# EAGLE design FluxamapadAwithAutoDetect (EAGLE 5.06)
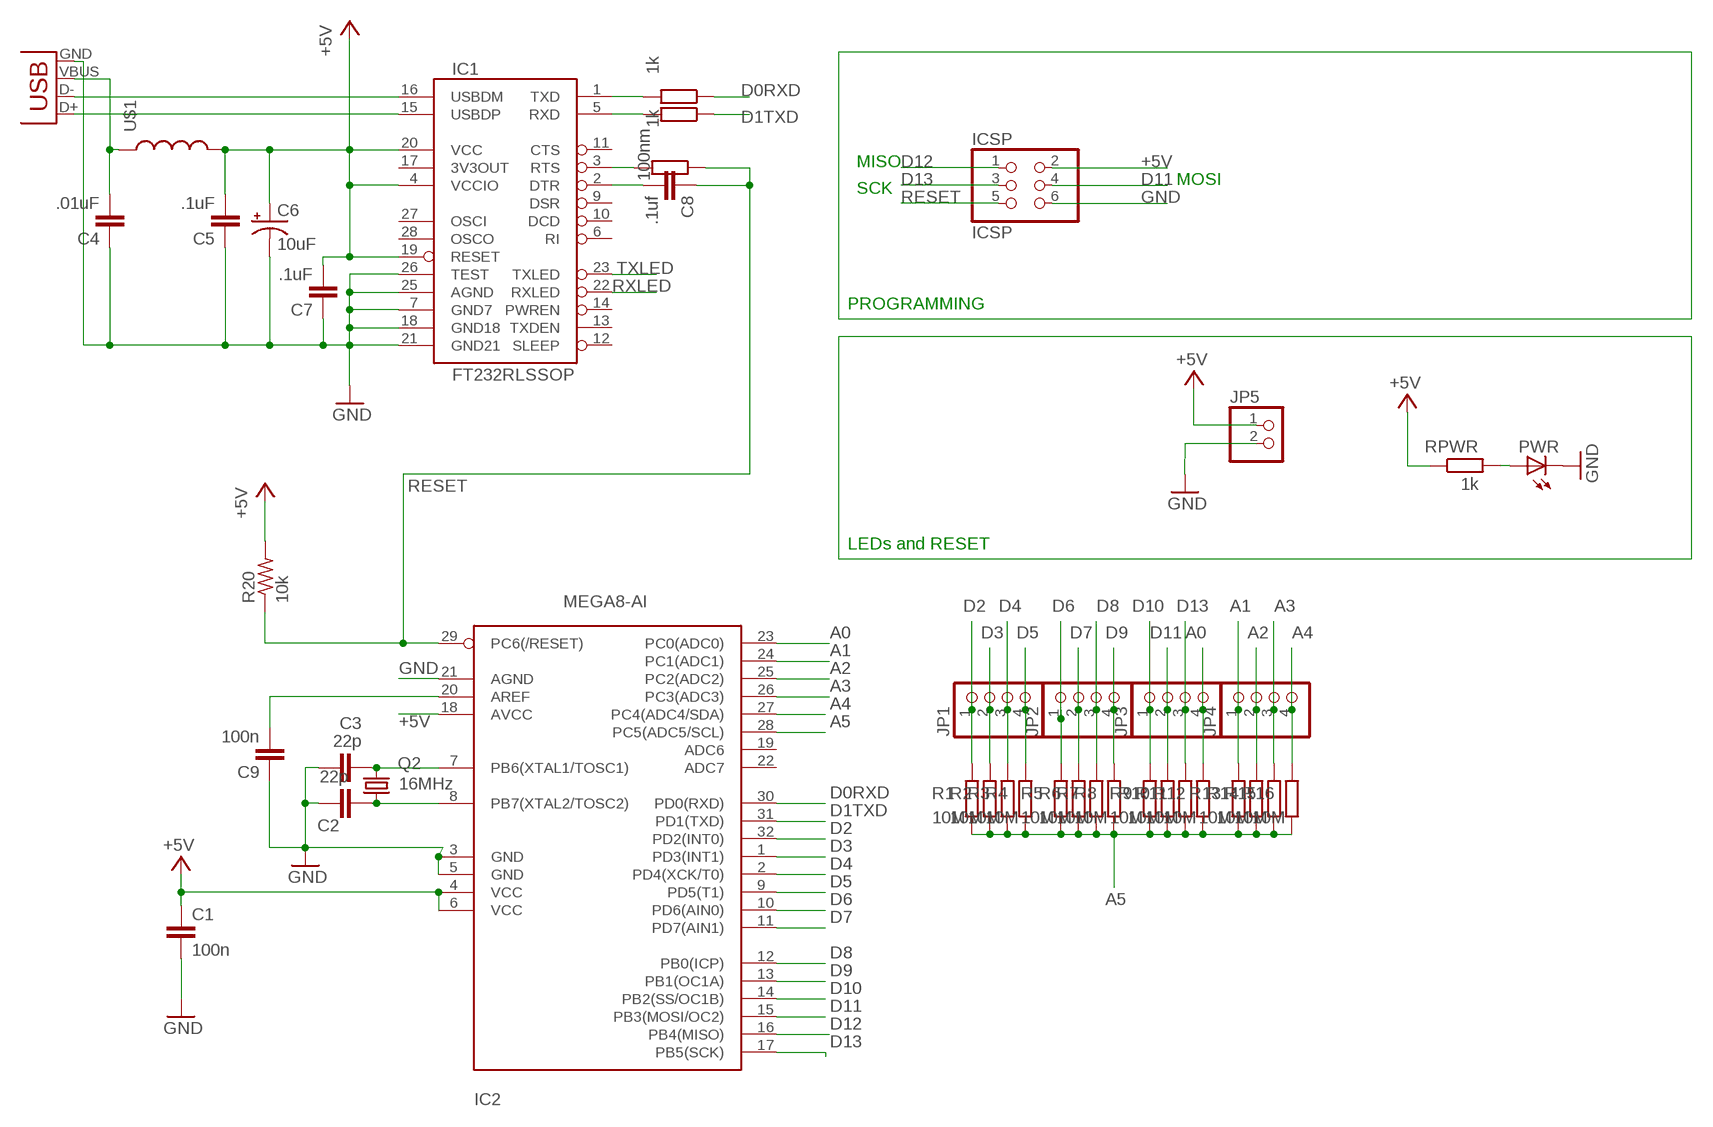
[diagram p0: schematic, sheet 1]

## Parts
C1  100n  C-EU  [C0805RND]
C2  22p  C-EU  [C0805RND]
C3  22p  C-EU  [C0805RND]
C4  .01uF  C-EU  [C0805RND]
C5  .1uF  C-EU  [C0805RND]
C6  10uF  CPOL-US150CLZ-1014  [150CLZ-1014]
C7  .1uF  C-EU  [C0805RND]
C8  .1uf  C-EU  [C0805RND]
C9  100n  C-EU  [C0805RND]
IC1  FT232RLSSOP  [SSOP28DB]
IC2  MEGA8-AI  [TQFP32-08]
ICSP  ICSP  PINHD-2X3  [2X03]
JP1  PINHD-1X4  [1X04]
JP2  PINHD-1X4  [1X04]
JP3  PINHD-1X4  [1X04]
JP4  PINHD-1X4  [1X04]
JP5  PINHD-1X2  [1X02]
PWR  LED0805ROUND  [0805RND]
Q2  16MHz  CRYTALHC49S  [HC49/S]
R1  10M  R-EU_R1206  [R1206]
R2  10M  R-EU_R1206  [R1206]
R3  10M  R-EU_R1206  [R1206]
R4  10M  R-EU_R1206  [R1206]
R5  10M  R-EU_R1206  [R1206]
R6  10M  R-EU_R1206  [R1206]
R7  10M  R-EU_R1206  [R1206]
R8  10M  R-EU_R1206  [R1206]
R9  10M  R-EU_R1206  [R1206]
R10  10M  R-EU_R1206  [R1206]
R11  10M  R-EU_R1206  [R1206]
R12  10M  R-EU_R1206  [R1206]
R13  10M  R-EU_R1206  [R1206]
R14  10M  R-EU_R1206  [R1206]
R15  10M  R-EU_R1206  [R1206]
R16  10M  R-EU_R1206  [R1206]
R17  1k  R-EU_R1206  [R1206]
R18  1k  R-EU_R1206  [R1206]
R19  100nm  R-EU_R1206  [R1206]
R20  10k  R-US_R1206  [R1206]
RPWR  1k  R-EU_R1206  [R1206]
U$1  INDUCTOR1206H*  [INDUCTOR-1206]
X1  USBPTH  [USB-B-PTH]

## Nets
+5V [usbvcc]: C1.1 C5.2 C6.+ C7.2 IC1.4(VCCIO) IC1.19(RESET) IC1.20(VCC) IC2.4(VCC) IC2.6(VCC) IC2.18(AVCC) ICSP.2 JP5.1 R20.2 RPWR.1 U$1.P$2
A0: IC2.23(PC0(ADC0)) JP3.4 R12.2
A1: IC2.24(PC1(ADC1)) JP4.1 R13.2
A2: IC2.25(PC2(ADC2)) JP4.2 R14.2
A3: IC2.26(PC3(ADC3)) JP4.3 R15.2
A4: IC2.27(PC4(ADC4/SDA)) JP4.4 R16.2
A5: IC2.28(PC5(ADC5/SCL)) R1.1 R2.1 R3.1 R4.1 R5.1 R6.1 R7.1 R8.1 R9.1 R10.1 R11.1 R12.1 R13.1 R14.1 R15.1 R16.1
D0RXD: IC2.30(PD0(RXD)) R17.1
D1TXD: IC2.31(PD1(TXD)) R18.1
D2: IC2.32(PD2(INT0)) JP1.1 R1.2
D3: IC2.1(PD3(INT1)) JP1.2 R2.2
D4: IC2.2(PD4(XCK/T0)) JP1.3 R3.2
D5: IC2.9(PD5(T1)) JP1.4 R4.2
D6: IC2.10(PD6(AIN0)) JP2.1 R5.2
D7: IC2.11(PD7(AIN1)) JP2.2 R6.2
D8: IC2.12(PB0(ICP)) JP2.3 R7.2
D9: IC2.13(PB1(OC1A)) JP2.4 R8.2
D10: IC2.14(PB2(SS/OC1B)) JP3.1 R9.2
D11: IC2.15(PB3(MOSI/OC2)) ICSP.4 JP3.2 R10.2
D12: IC2.16(PB4(MISO)) ICSP.1
D13: IC2.17(PB5(SCK)) ICSP.3 JP3.3 R11.2
GND [gnd]: C1.2 C2.1 C3.1 C4.1 C5.1 C6.- C7.1 C9.1 IC1.7(GND7) IC1.18(GND18) IC1.21(GND21) IC1.25(AGND) IC1.26(TEST) IC2.3(GND) IC2.5(GND) IC2.21(AGND) ICSP.6 JP5.2 PWR.P$2(C) X1.GND
N$1: C4.2 U$1.P$1 X1.VBUS
N$2: C9.2 IC2.20(AREF)
N$3: PWR.P$1(A) RPWR.2
N$6: IC1.3(RTS) R19.2
N$7: C3.2 IC2.7(PB6(XTAL1/TOSC1)) Q2.2
N$8: IC1.15(USBDP) X1.D+
N$9: IC1.1(TXD) R17.2
N$10: IC1.16(USBDM) X1.D-
N$11: IC1.5(RXD) R18.2
N$12: C8.2 IC1.2(DTR)
N$24: C2.2 IC2.8(PB7(XTAL2/TOSC2)) Q2.1
RESET: C8.1 IC2.29(PC6(/RESET)) ICSP.5 R19.1 R20.1
RXLED: IC1.22(RXLED)
TXLED: IC1.23(TXLED)
Unconnected: IC1.6(RI) IC1.9(DSR) IC1.10(DCD) IC1.11(CTS) IC1.12(SLEEP) IC1.13(TXDEN) IC1.14(PWREN) IC1.17(3V3OUT) IC1.27(OSCI) IC1.28(OSCO) IC2.19(ADC6) IC2.22(ADC7)

## Notes on the sheet
- MISO
- MOSI
- SCK
- PROGRAMMING
- LEDs and RESET

## Library data of the parts
C1-C5 C7-C9 = rcl:C-EU: CAPACITOR, European symbol
C6 = rcl:CPOL-US: POLARIZED CAPACITOR, American symbol
IC1 = SparkFun:FT232RL: USB UART FT232RL 4th Generation USB UART (USB <-> Serial) Controller. Spark Fun Electronics SKU : COM-00650
IC2 = atmel:MEGA8: MICROCONTROLLER 8 Kbytes FLASH, 1 kbytes SRAM, 512 bytes EEPROM, USART, 6-channel 10 bit ADC, 2-channel 8 bit ADC Pin compatible with Atmega48, ATMega88, ATMega168 Source: avr.lbr
ICSP = pinhead:PINHD-2X3: PIN HEADER
JP1-JP4 = pinhead:PINHD-1X4: PIN HEADER
JP5 = pinhead:PINHD-1X2: PIN HEADER
PWR = led:LED: LED OSRAM: - CHIPLED LG R971, LG N971, LY N971, LG Q971, LY Q971, LO R971, LY R971 LH N974, LH R974 LS Q976, LO Q976, LY Q976 LO Q996 - Hyper CHIPLED LW Q18S LB Q993, LB Q99A, LB R99A - SideLED LS A670, LO A670, LY A670, LG A670, LP A670 LB A673, LV A673, LT A673, LW A673 LH A674 LY A675 LS A676, LA A676, LO A676, LY A676, LW A676 LS A679, LY A679, LG A679 - Hyper Micro SIDELED® LS Y876, LA Y876, LO Y876, LY Y876 LT Y87S - SmartLED LW L88C, LW L88S LB L89C, LB L89S, LG L890 LS L89K, LO L89K, LY L89K LS L896, LA L896, LO L896, LY L896 - TOPLED LS T670, LO T670, LY T670, LG T670, LP T670 LSG T670, LSP T670, LSY T670, LOP T670, LYG T670 LG T671, LOG T671, LSG T671 LB T673, LV T673, LT T673, LW T673 LH T674 LS T676, LA T676, LO T676, LY T676, LB T676, LH T676, LSB T676, LW T676 LB T67C, LV T67C, LT T67C, LS T67K, LO T67K, LY T67K, LW E67C LS E67B, LA E67B, LO E67B, LY E67B, LB E67C, LV E67C, LT E67C LW T67C LS T679, LY T679, LG T679 LS T770, LO T770, LY T770, LG T770, LP T770 LB T773, LV T773, LT T773, LW T773 LH T774 LS E675, LA E675, LY E675, LS T675 LS T776, LA T776, LO T776, LY T776, LB T776 LHGB T686 LT T68C, LB T68C - Hyper Mini TOPLED® LB M676 - Mini TOPLED Santana® LG M470 LS M47K, LO M47K, LY M47K Source: http://www.osram.convergy.de/
Q2 = crystal:CRYTAL: CRYSTAL
R1-R19 RPWR = rcl:R-EU_: RESISTOR, European symbol
R20 = rcl:R-US_: RESISTOR, American symbol
U$1 = SparkFun:INDUCTOR: Inductors Basic Inductor/Choke - 0603 and 1206. Footprints are not proven and vary greatly between part numbers.
X1 = SparkFun:USB: USB Connectors USB-B-PTH is fully proven SKU : PRT-00139 USB-miniB is fully proven SKU : PRT-00587 USB-A-PCB is untested. USB-A-H is throughly reviewed, but untested. Spark Fun Electronics SKU : PRT-00437 USB-B-SMT is throughly reviewed, but untested. Needs silkscreen touching up. USB-A-S has not been used/tested USB-MB-H has not been used/tested

## Net classes
0 default: width 0.254 mm, drill 0.305 mm, clearance 0.152 mm
1 power: width 0.61 mm, drill 0.508 mm, clearance 0.152 mm
2 gnd: width 0.305 mm, drill 0.508 mm, clearance 0.152 mm
3 usbvcc: width 0.508 mm, drill 0.508 mm, clearance 0.152 mm
4 aref: width 0.406 mm

## Board
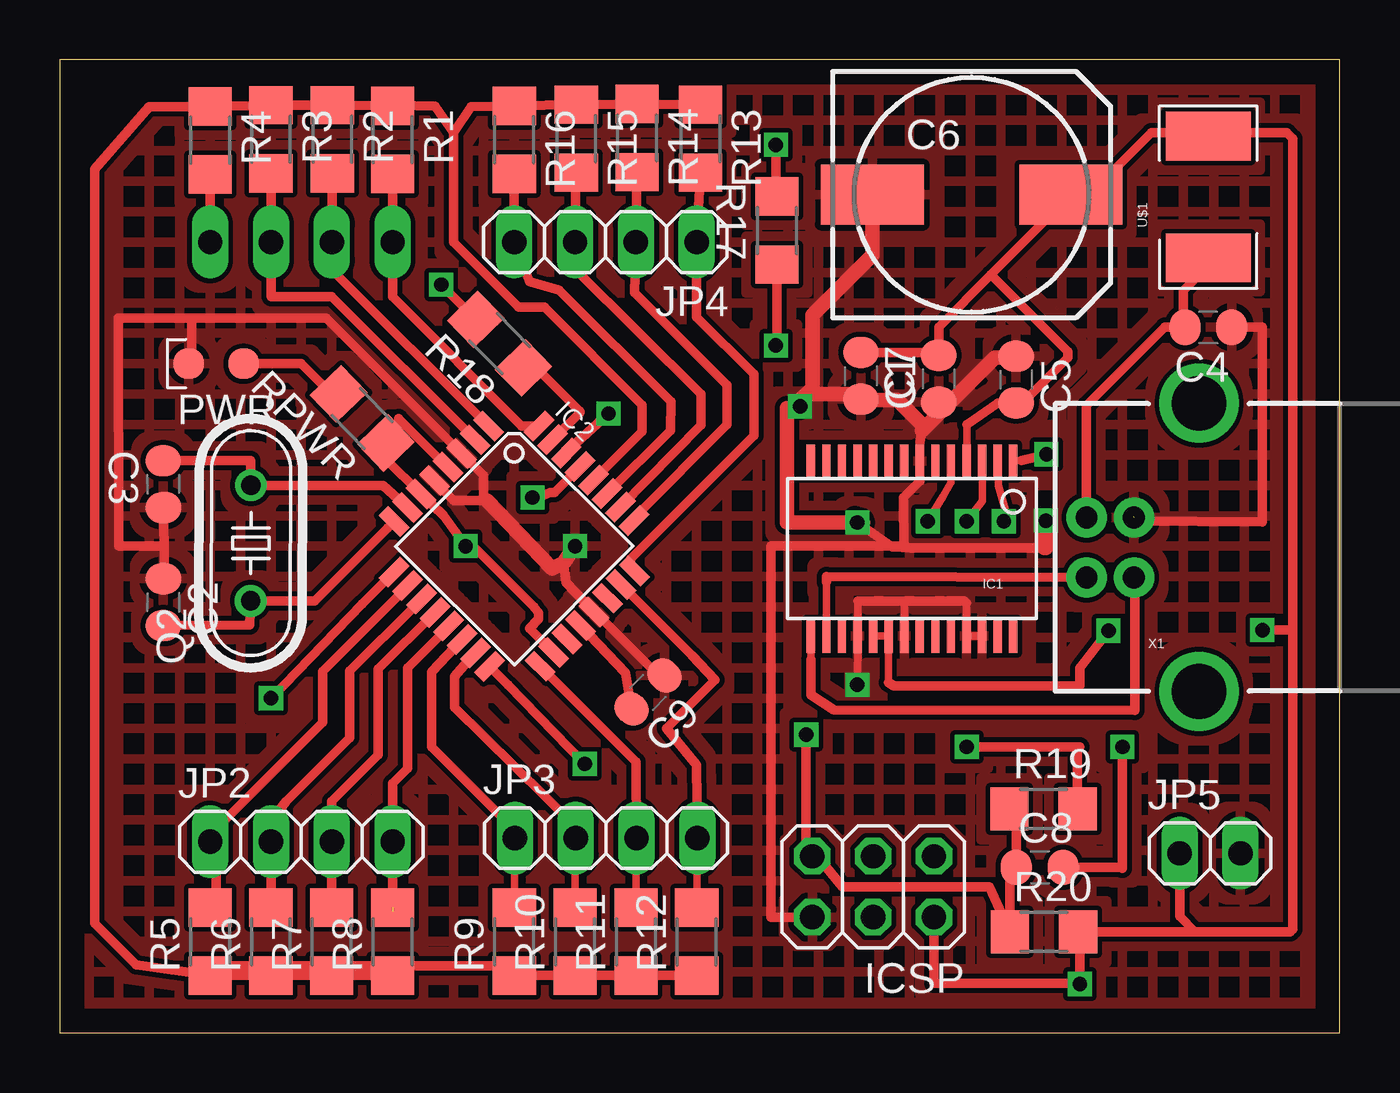
[diagram p1: board, top side]
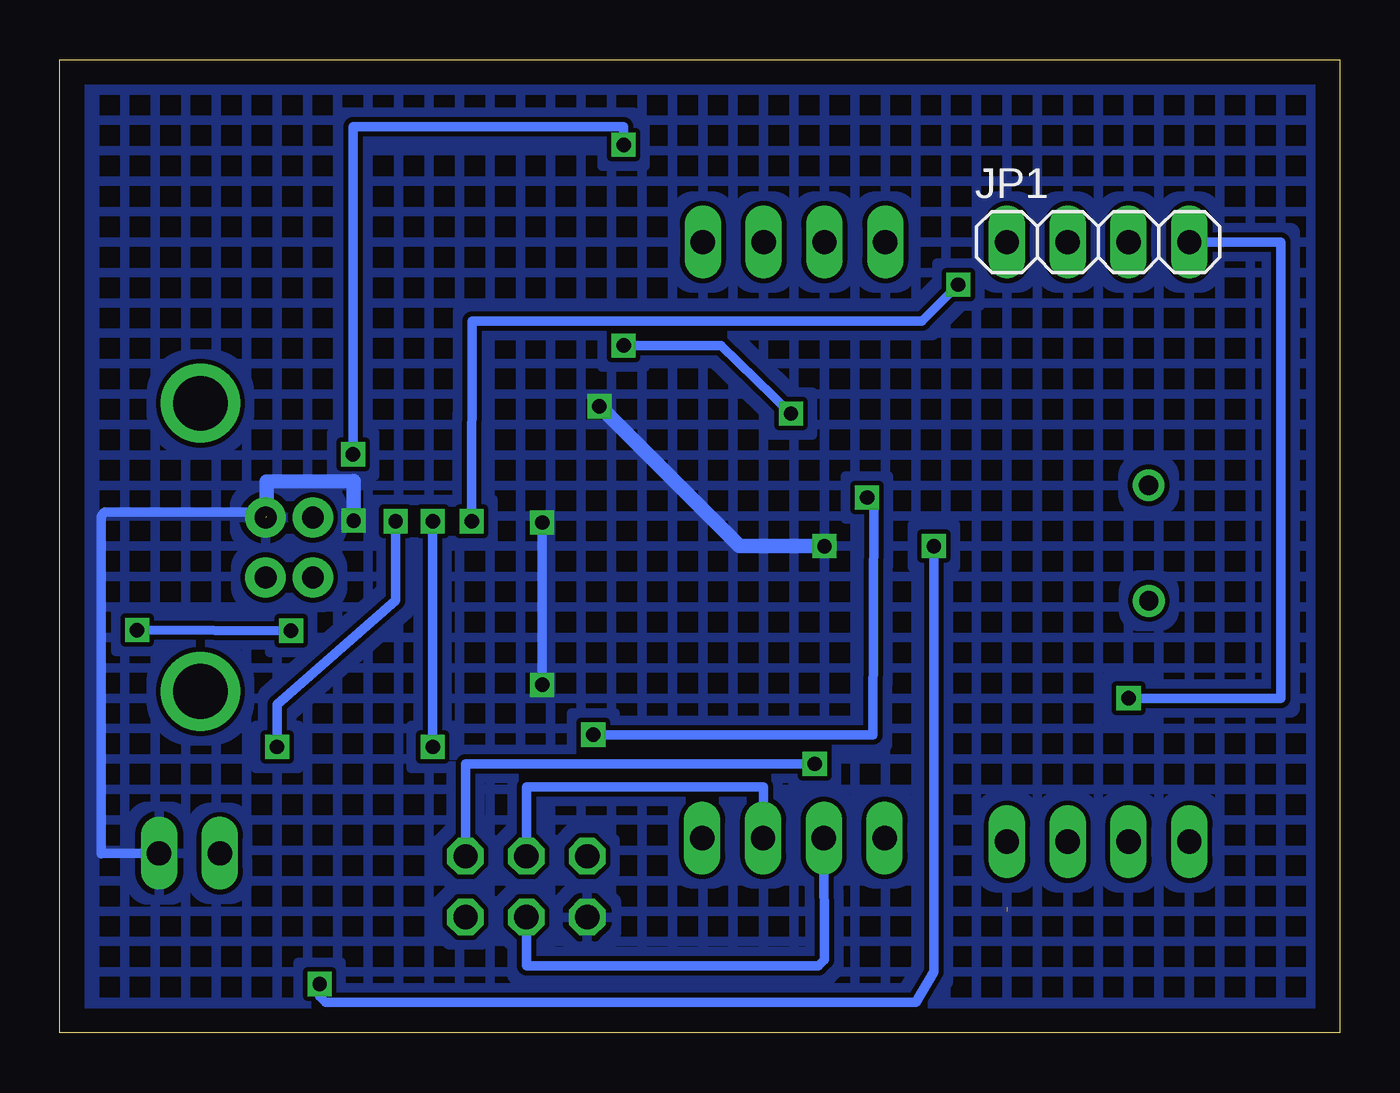
[diagram p2: board, bottom side, seen from below]

Size 53.44 x 40.63 mm. Coordinates in mm from the lower left corner, seen from the top.
Outline: 0,0 53.44,0 53.44,40.63 0,40.63 0,0
Copper layers (1*16): Top 0.035mm / dielectric 1.5mm / Bottom 0.035mm
Design rules "default": minimum track width 10mil, minimum drill 24mil, track to track 8mil, track to pad 8mil, pad to pad 8mil, via to via 8mil, smd to smd 8mil, copper to edge 40mil, drill to drill 8mil, minimum pad ring 10mil, minimum via ring 8mil, stop-mask expansion 4mil, vias tented up to drill 0mil, thermal gap 10mil

### Footprints (pad centres in the part's own frame; a part is rotated, then mirrored left to right if it is on the bottom)
C0805RND = smd 1.3 x 1.5: 1 -0.977,0; 2 0.977,0
150CLZ-1014 = smd 4.3 x 2.5: + 4.15,0; - -4.15,0
SSOP28DB = smd 0.348 x 1.397: 1 -4.225,-3.656; 2 -3.575,-3.656; 3 -2.925,-3.656; 4 -2.275,-3.656; 5 -1.625,-3.656; 6 -0.975,-3.656; 7 -0.325,-3.656; 8 0.325,-3.656; 9 0.975,-3.656; 10 1.625,-3.656; 11 2.275,-3.656; 12 2.925,-3.656; 13 3.575,-3.656; 14 4.225,-3.656; 15 4.225,3.656; 16 3.575,3.656; 17 2.925,3.656; 18 2.275,3.656; 19 1.625,3.656; 20 0.975,3.656; 21 0.325,3.656; 22 -0.325,3.656; 23 -0.975,3.656; 24 -1.625,3.656; 25 -2.275,3.656; 26 -2.925,3.656; 27 -3.575,3.656; 28 -4.225,3.656
TQFP32-08 = smd 1.27 x 0.559: 1 -4.293,2.8; 2 -4.293,2; 3 -4.293,1.2; 4 -4.293,0.4; 5 -4.293,-0.4; 6 -4.293,-1.2; 7 -4.293,-2; 8 -4.293,-2.8; 17 4.293,-2.8; 18 4.293,-2; 19 4.293,-1.2; 20 4.293,-0.4; 21 4.293,0.4; 22 4.293,1.2; 23 4.293,2; 24 4.293,2.8 | smd 0.559 x 1.27: 9 -2.8,-4.293; 10 -2,-4.293; 11 -1.2,-4.293; 12 -0.4,-4.293; 13 0.4,-4.293; 14 1.2,-4.293; 15 2,-4.293; 16 2.8,-4.293; 25 2.8,4.293; 26 2,4.293; 27 1.2,4.293; 28 0.4,4.293; 29 -0.4,4.293; 30 -1.2,4.293; 31 -2,4.293; 32 -2.8,4.293
2X03 = drill 1.016 octagon: 1 -2.54,-1.27; 2 -2.54,1.27; 3 0,-1.27; 4 0,1.27; 5 2.54,-1.27; 6 2.54,1.27
1X04 = drill 1.016 long: 1 -3.81,0; 2 -1.27,0; 3 1.27,0; 4 3.81,0
1X02 = drill 1.016 long: 1 -1.27,0; 2 1.27,0
0805RND = smd 1.27 x 1.27: P$1 -1.143,0; P$2 1.143,0
HC49/S = drill 0.813 round: 1 -2.413,0; 2 2.413,0
R1206 = smd 1.6 x 1.803: 1 -1.422,0; 2 1.422,0
INDUCTOR-1206 = smd 2.032 x 3.556: P$1 -2.54,0; P$2 2.54,0
USB-B-PTH = drill 0.914 pad 1.676 round: D+ 0,1.25; D- 1.981,1.25; GND 0,-1.25; VBUS 1.981,-1.25 | drill 2.286 round: P$1 -2.718,-6.02; P$2 -2.718,6.02

### Placement (x,y rotation side)
C1  33.45,27.43 270 top
C2  4.32,17.98 269.8 top
C3  4.32,22.91 90.2 top
C4  47.96,29.46 180 top
C5  39.93,27.28 270 top
C6  38.07,35 0 top
C7  36.7,27.3 90 top
C8  40.92,6.91 0 top
C9  24.56,14.22 225 top
IC1  35.59,20.22 180 top
IC2  18.97,20.32 315.2 top
ICSP  33.96,6.1 180 top
JP1  10.08,33.02 0 bottom
JP2  10.08,7.98 0 top
JP3  22.81,8.13 0 top
JP4  22.78,33.02 180 top
JP5  48.03,7.49 0 top
PWR  6.53,27.94 180 top
Q2  7.98,20.45 89.8 top
R1  13.89,37.29 270 top
R2  11.38,37.31 270 top
R3  8.81,37.31 270 top
R4  6.27,37.26 270 top
R5  6.27,3.81 90 top
R6  8.81,3.81 90 top
R7  11.35,3.81 90 top
R8  13.89,3.81 90 top
R9  18.97,3.81 90 top
R10  21.51,3.81 90 top
R11  24.05,3.81 90 top
R12  26.59,3.81 90 top
R13  26.75,37.34 270 top
R14  24.1,37.36 270 top
R15  21.56,37.34 270 top
R16  18.97,37.29 270 top
R17  29.95,33.5 90.1 top
R18  18.36,28.78 134.4 top
R19  41.07,9.35 0 top
R20  41.1,4.22 0 top
RPWR  12.62,25.65 133.8 top
U$1  47.96,34.9 90 top
X1  44.86,20.27 180 top

### Tracks (layer width: path | path; a pad name or v marks a point on that pad's centre or on a via)
+5V  (via drill 0.6)
  Top 0.305: 37.87,25.4 37.87,24.75 IC1.4 | IC1.20 IC1.19 | IC1.20 34.01,16.56 33.96,16.51 | 34.61,14.62 IC1.20
  Top 0.406: IC2.18 20.1,16.4 19.61,16.89 19.99,17.27 19.99,17.53 19.8,17.78 17.26,20.32 v16.94,20.32 16.02,21.59 IC2.6 | IC2.6 13.61,23.97 RPWR.1 14.15,25.17 14.15,25.65 16.17,23.63 IC2.4 | 38.88,31.66 36.7,29.48 C7.2 36.58,28.41 C1.1 | 38.88,31.66 C6.+ 42.99,35 45.58,37.59 48.18,37.59 48.03,37.44 U$1.P$2 48.11,37.59 51.23,37.59 51.49,37.34 51.49,16.82 | 37.87,25.4 39.18,26.3 C5.2 40.2,26.3 42.09,28.19 42.09,28.45 38.88,31.66 | 47.4,4.22 R20.2 42.6,4.14 42.6,2.06 | 47.4,4.22 51.38,4.22 51.49,4.32 51.49,16.82 | v42.6,2.03 42.6,2.06 | IC2.6 15.08,22.52 14.86,22.61 14.91,22.61 | ICSP.2 36.5,2.06 42.6,2.06 | 34.61,14.62 34.82,14.48 42.6,14.48 42.6,15.24 v43.79,16.79 | 51.49,16.82 v50.22,16.82 | JP5.1 46.76,4.85 47.4,4.22
  Bottom 0.406: v16.94,20.32 16.94,2.54 17.7,1.27 42.34,1.27 42.6,1.52 v42.6,2.03 | v50.22,16.82 v43.79,16.79
A0
  Top 0.305: JP3.4 R12.2
  Top 0.406: JP3.4 26.59,11.18 25.32,12.7 27.36,14.73 26.39,15.75 IC2.23
A1
  Top 0.406: R13.2 JP4.1 26.59,29.9 28.98,27.51 28.98,24.94 23.82,19.79 23.82,19.45 IC2.24
A2
  Top 0.406: IC2.25 24.05,21.46 24.05,21.59 27.86,25.4 27.86,27.05 24,30.91 JP4.2 R14.2
A3
  Top 0.406: IC2.26 26.77,25.39 26.77,26.67 21.54,31.88 JP4.3 R15.2
A4
  Top 0.406: IC2.27 25.5,25.15 25.53,26.36 20.85,31.01 19.61,31.37 JP4.4 R16.2
A5
  Top 0.406: 16.43,37.59 15.66,38.7 14.06,38.74 R1.1 R2.1 R3.1 R4.1 3.95,38.68 3.73,38.68 1.45,36.07 1.45,4.57 3.19,2.83 R5.1 | 16.43,37.59 16.43,33.02 19.15,30.3 20.24,30.3 24.31,26.21 24.31,25.11 IC2.28 | R13.1 R14.1 R15.1 R16.1 17.18,38.67 16.43,37.59 | R8.1 R7.1 R6.1 R5.1 | R5.1 5.8,2.83 5.77,2.79 18.93,2.79 R9.1 R10.1 R11.1 R12.1
D0RXD  (via drill 0.6)
  Top 0.406: R17.1 29.95,28.75 v29.9,28.7 | v22.91,25.86 21.57,24.64 IC2.30
  Bottom 0.406: v29.9,28.7 25.83,28.7 v22.91,25.86
D1TXD
  Top 0.406: R18.1 19.91,27.76 21.69,25.96 21.71,25.91 IC2.31
D2
  Top 0.406: IC2.32 19.29,25.34 13.89,30.73 JP1.1 R1.2
D3
  Top 0.406: IC2.1 11.35,31.88 JP1.2 R2.2
D4
  Top 0.406: IC2.2 11.35,30.73 8.81,30.73 JP1.3 R3.2
D5  (via drill 0.6)
  Top 0.406: v8.81,13.97 12.62,17.91 IC2.9 | R4.2 JP1.4
  Bottom 0.406: JP1.4 2.46,33.02 2.46,13.97 v8.81,13.97
D6
  Top 0.406: IC2.10 14.57,18.68 10.97,15.09 10.97,12.95 6.27,8.26 JP2.1 | JP2.1 6.02,7.62 | JP2.1 6.53,7.62 6.53,5.04 R5.2
D7
  Top 0.406: IC2.11 14.87,17.87 12.09,15.11 12.09,12.32 9.45,9.65 8.81,8.87 JP2.2 R6.2
D8
  Top 0.406: IC2.12 13.28,15.2 13.28,11.61 11.35,9.65 JP2.3 R7.2
D9  (1 unrouted)
  Top 0.406: 13.89,5.08 JP2.4 13.89,10.41 14.53,11.05 14.53,15.24 16.23,16.94 IC2.13
D10
  Top 0.305: JP3.1 R9.2
  Top 0.406: JP3.1 18.97,8.48 15.52,11.94 15.52,15.07 IC2.14
D11
  Top 0.305: R10.2 21.54,5.23 21.54,5.26 21.51,5.26 | 21.51,5.26 21.51,5.18 | JP3.2 21.51,5.26
  Top 0.406: JP3.2 21.51,8.64 16.48,13.59 16.48,14.88 17,15.49 IC2.15
  Bottom 0.406: ICSP.4 33.96,2.79 21.77,2.79 21.51,3.05 JP3.2
D12  (via drill 0.6)
  Top 0.406: v21.92,11.23 18.72,14.52 IC2.16
  Bottom 0.406: ICSP.1 36.5,11.23 v21.92,11.23
D13
  Top 0.305: JP3.3 R11.2
  Top 0.406: JP3.3 24.05,11.3 IC2.17
  Bottom 0.406: ICSP.3 33.96,10.26 24.05,10.26 JP3.3
GND  (via drill 0.6)  (1 unrouted)
  Top 0.305: 35.92,24.64 IC1.7 35.91,23.03 | IC1.26 IC1.25 37.86,17.94 | 35.26,18 IC1.21 | 33.32,18.03 33.32,16.68 IC1.18 33.32,16.45 v33.3,14.53 | 41.12,20.24 41.15,20.45 | X1.GND 44.86,21.42 44.8,21.36
  Top 0.406: IC2.21 22.3,17.63 | 17.7,22.22 17.7,23.27 IC2.3 11.12,29.84 5.51,29.84 | IC2.5 15.65,23.01 16.43,22.22 17.7,22.22 | IC2.21 22.35,17.58 24.82,15.11 25.45,14.86 | 25.45,14.86 C9.1 | 4.35,20.32 4.35,19.49 C2.1 | 4.35,20.32 C3.1 | 5.51,29.84 2.44,29.84 2.46,20.32 4.35,20.32 | C4.1 50.22,29.46 50.22,21.34 44.8,21.36 | C7.1 36.7,26.36 36.75,26.42 | 36.75,25.91 36.75,26.42 | 35.92,24.64 35.99,25.15 35.99,25.4 | 36.75,26.42 37.26,26.42 | 39.87,28.19 C5.1 | 33.49,26.42 C1.2 33.24,26.67 | 35.91,23.03 35.23,22.35 35.25,20.27 35.51,20.24 | 33.32,18.03 35.23,18.03 35.26,18 35.29,18.03 37.77,18.03 37.86,17.94 | 35.51,20.24 41.12,20.24 | PWR.P$2 5.38,27.81 5.51,27.69 5.51,29.84 | 31.42,26.92 31.42,26.67 | 25.45,14.86 25.2,14.86 25.07,14.99 | 17.7,22.22 17.83,22.22 | v30.91,26.16 30.91,26.42 | 21.03,19.61 21.13,18.8 IC2.21 | ICSP.6 29.69,4.83 29.69,20.32 35.23,20.32 35.51,20.24 | 35.51,20.24 34.77,20.29 v33.3,21.31
  Top 0.61: 35.99,25.15 36.75,25.91 | 37.26,26.42 39.04,28.19 39.87,28.19 | 33.49,26.42 34.98,26.42 35.99,25.4 | 41.12,20.24 41.17,20.24 | C6.- 33.92,32.48 31.42,29.97 31.42,26.92 30.91,26.42 | 31.42,26.67 33.24,26.67 | 17.83,22.22 20.55,19.38 21.03,19.61 v21.51,20.32 | 41.15,20.45 v41.17,21.39
  Bottom 0.406: v33.3,21.31 v33.3,14.53 | JP5.2 51.69,7.49 51.71,7.47 51.71,21.59 51.56,21.74 45.08,21.74 X1.GND
  Bottom 0.61: v21.51,20.32 25.07,20.32 v30.91,26.16 | 44.83,21.57 44.81,23.01 41.17,23.04 v41.17,21.39
  pour Top (hatched): 1.02,39.5 52.43,39.5 52.43,1.09 1.14,1.09 1.14,1.32 0.97,1.32 0.97,39.57
  pour Bottom (hatched): 1.14,39.62 51.94,39.57 52.43,39.45 52.43,1.02 1.02,1.02 1.07,37.21
N$1
  Top 0.406: X1.VBUS 42.87,26.19 46.15,29.46 C4.2 46.91,29.53 46.91,30.99 47.95,32.03 U$1.P$1
N$2
  Top 0.406: C9.2 23.63,15.02 IC2.20
N$3
  Top 0.406: RPWR.2 11.34,26.68 10.08,27.94 PWR.P$1
N$4
  Top 0.61: 30.89,26.09 30.35,26.09 30.35,21.31 33.53,21.31 33.2,21.49 33.5,21.41
N$6  (via drill 0.6)
  Top 0.305: IC1.3 38.53,23.85 38.53,22.2 v37.87,21.36
  Top 0.406: R19.2 42.49,11.79 42.6,11.94 v37.87,11.94
  Bottom 0.406: v37.87,11.94 v37.87,21.36
N$7
  Top 0.406: 14.43,21.99 14.43,21.93 IC2.7 13.51,22.86 Q2.2 8.03,22.94 7.95,22.96 7.96,23.89 C3.2
N$8
  Top 0.305: 31.34,16.5 IC1.15 31.37,15.58
  Top 0.406: X1.D+ 44.86,18.77 44.88,18.8 44.88,13.46 32.33,13.49 31.37,14.1 31.37,15.58
N$9  (via drill 0.6)
  Top 0.305: IC1.1 40.16,23.9
  Top 0.406: 40.16,23.9 v41.2,24.16 | v29.9,37.08 29.9,34.97 R17.2
  Bottom 0.406: v41.2,24.16 41.2,37.85 29.9,37.85 v29.9,37.08
N$10
  Top 0.305: 32,18.82 32,16.67 IC1.16
  Top 0.406: X1.D- 32.01,19.04 32,18.82
N$11  (via drill 0.6)
  Top 0.305: IC1.5 | IC1.5 37.21,22.99 36.88,22.4 v36.25,21.36
  Top 0.406: R18.2 v15.93,31.24
  Bottom 0.406: v15.93,31.24 17.45,29.72 36.22,29.72 v36.25,21.36
N$12  (via drill 0.6)
  Top 0.305: IC1.2 39.17,23.38 39.19,22.86 39.57,21.54 v39.42,21.36
  Top 0.406: C8.2 44.32,6.91 44.37,6.86 v44.37,11.94
  Bottom 0.406: v44.37,11.94 44.37,13.72 39.42,18.06 v39.42,21.36
N$24
  Top 0.406: 13.68,21.08 IC2.8 10.63,18.03 Q2.1 7.93,17.03 C2.2
RESET  (via drill 0.6)
  Top 0.406: 31.17,7.62 ICSP.5 | 31.17,7.62 31.42,7.62 32.69,6.1 38.81,6.1 R20.1 39.67,6.9 C8.1 39.94,9.56 R19.1 | 31.17,7.62 v31.17,12.45 | v19.74,22.35 19.99,22.35 20.47,22.55 20.65,22.55 IC2.29
  Bottom 0.406: ICSP.5 31.42,7.62 | v31.17,12.45 19.48,12.45 19.46,22.28 v19.74,22.35